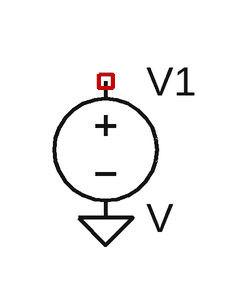
[diagram p0: schematic Draft2.asc]
Draft2.asc, the LTspice schematic file:
Version 4.1
SHEET 1 880 680
FLAG 48 208 0
SYMBOL voltage 48 112 R0
SYMATTR InstName V1

The netlist it stands for:
* Draft2.asc
V1 NC_01 0 V
.backanno
.end